# Altium schematic sheet main.SCHDOC
size B
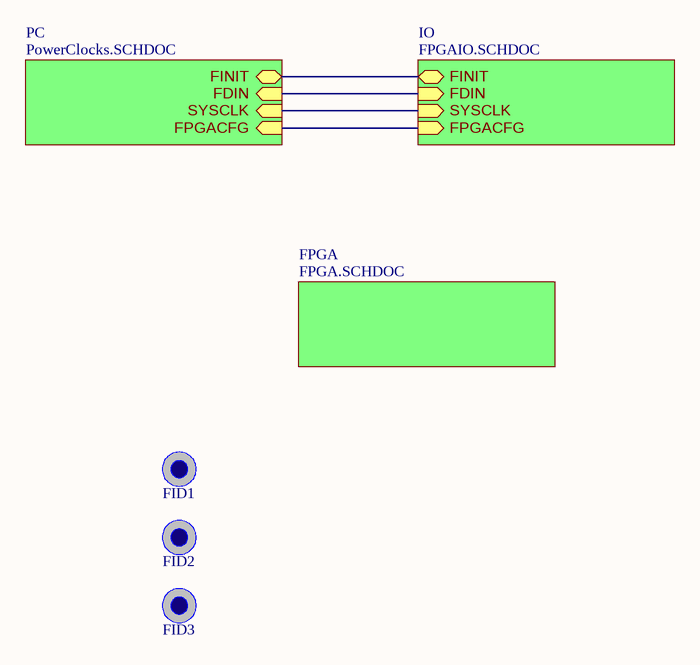
[diagram p0: main.SCHDOC]

## Parts
FID1  *  [FIDUCIAL]  (value not drawn)
FID2  *  [FIDUCIAL]  (value not drawn)
FID3  *  [FIDUCIAL]  (value not drawn)

## Sub-sheets
FPGA = FPGA.SCHDOC: no entries
IO = FPGAIO.SCHDOC: FPGACFG (in), SYSCLK (in), FINIT (bidir), FDIN (in)
PC = PowerClocks.SCHDOC: FINIT (bidir), FDIN (in), SYSCLK (in), FPGACFG (in)

## Nets
(unnamed): sheet PC/FINIT, sheet IO/FINIT
(unnamed): sheet PC/FDIN, sheet IO/FDIN
(unnamed): sheet PC/SYSCLK, sheet IO/SYSCLK
(unnamed): sheet PC/FPGACFG, sheet IO/FPGACFG

## Notes on the sheet
- Title:
- Engineer:
- Date:
- Revision:
- Sheet
- of
- File:

## Library data of the parts
FID1-FID3 = FIDUCIAL